# EAGLE design ATtiny45 development board (EAGLE 5.06)
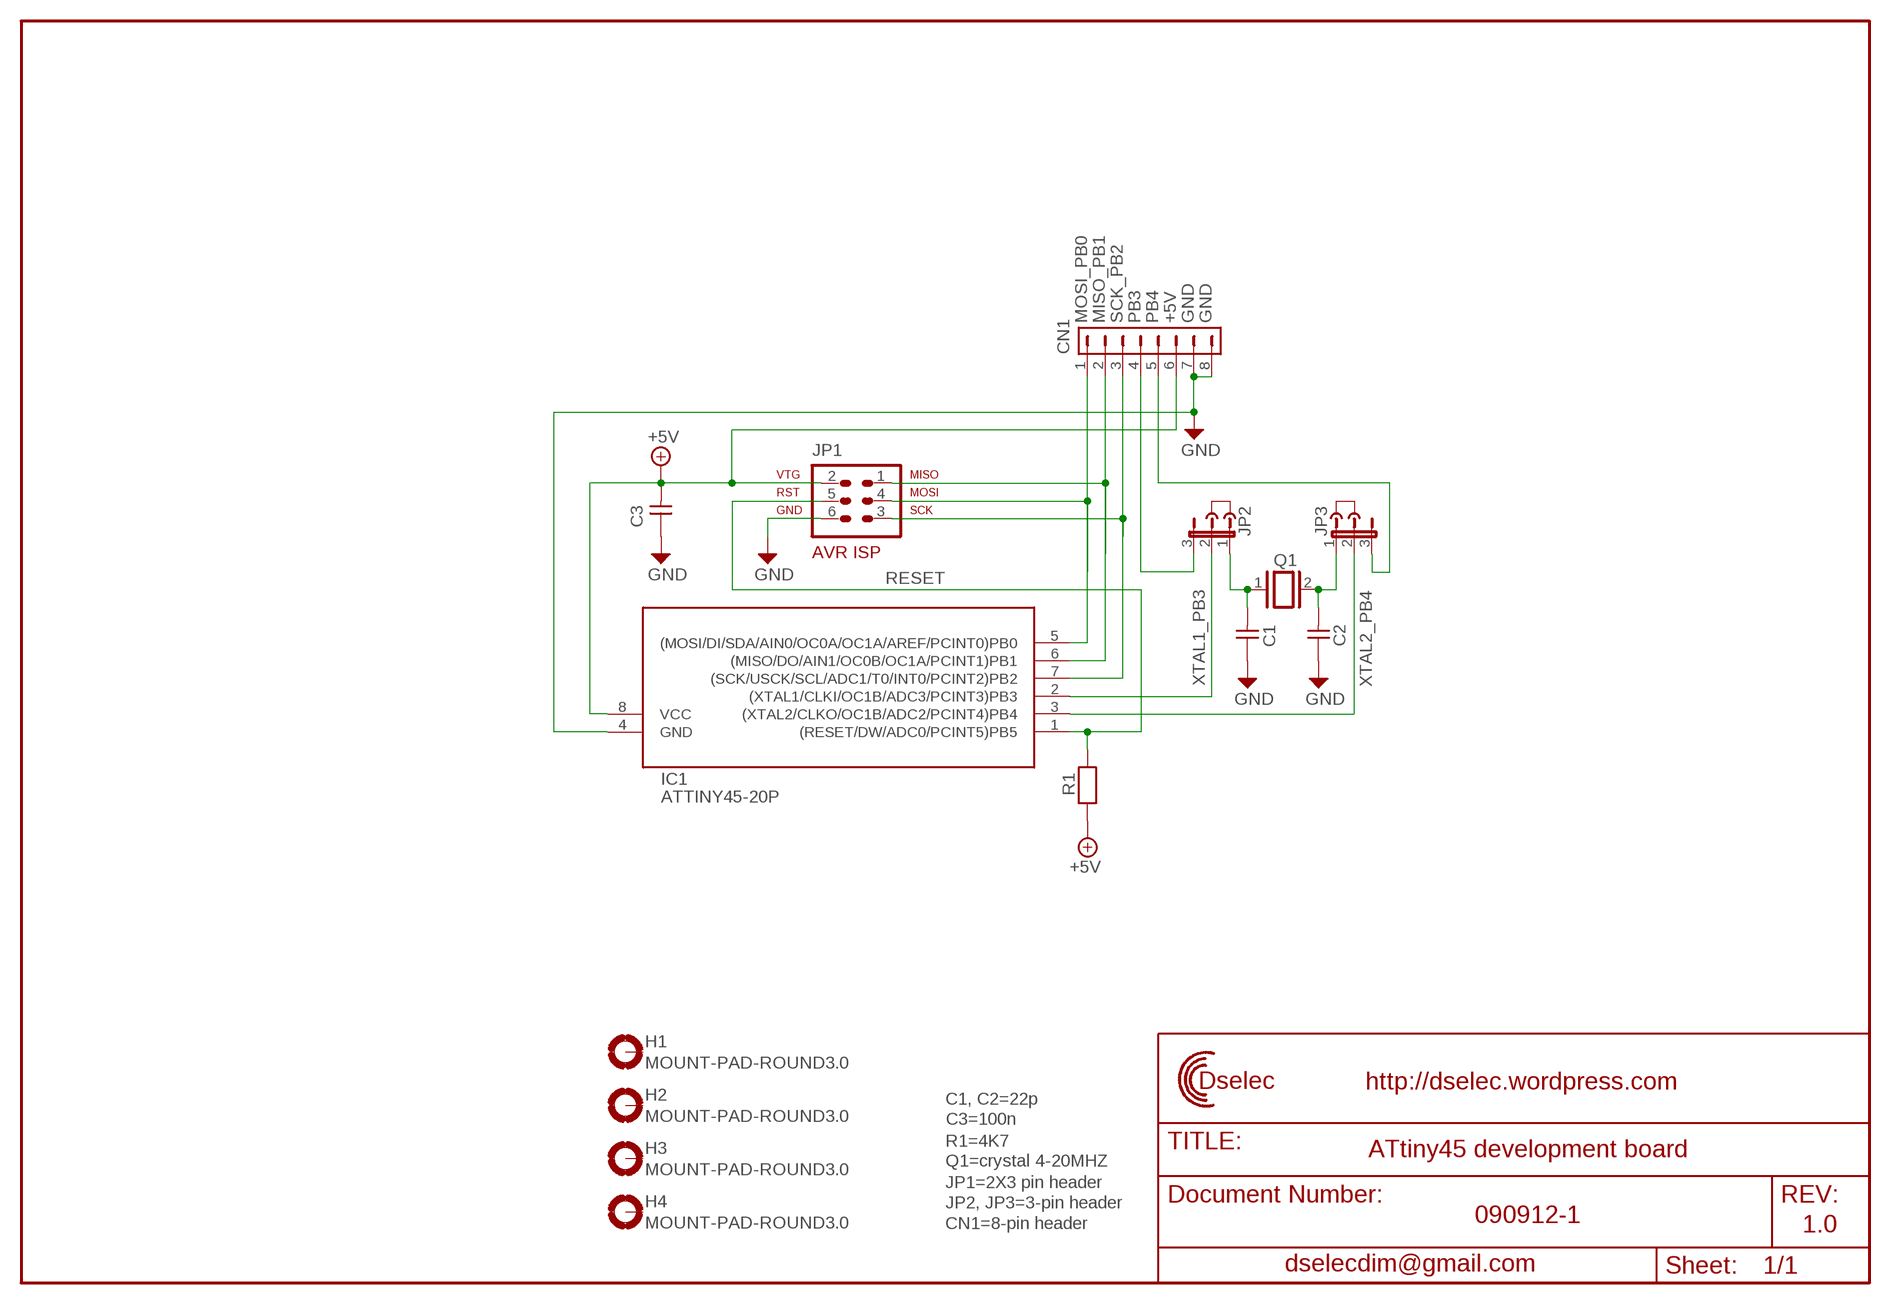
[diagram p0: schematic, sheet 1]

## Parts
C1  CAPNP-2,5  [C-2,5]
C2  CAPNP-2,5  [C-2,5]
C3  CAPNP-5  [C-5]
CN1  HDR-1X8-SIP-100  [SIP-100-8V]
H1  MOUNT-PAD-ROUND3.0  [3,0-PAD]
H2  MOUNT-PAD-ROUND3.0  [3,0-PAD]
H3  MOUNT-PAD-ROUND3.0  [3,0-PAD]
H4  MOUNT-PAD-ROUND3.0  [3,0-PAD]
IC1  ATTINY45-20P  [DIL08]
J1  JUMPER  [JUMP]
J2  JUMPER  [JUMP]
JP1  AVR-ISP-6  [AVR-ISP-6]
JP2  JP2E  [JP2]
JP3  JP2E  [JP2]
Q1  XTAL/S  [QS]
R1  RESEU-10  [R-10]

## Nets
+5V: C3.2 CN1.6 IC1.8(VCC) JP1.2 R1.1
GND: C1.1 C2.1 C3.1 CN1.7 CN1.8 IC1.4(GND) JP1.6
MISO_PB1: CN1.2 IC1.6((MISO/DO/AIN1/OC0B/OC1A/PCINT1)PB1) JP1.1
MOSI_PB0: CN1.1 IC1.5((MOSI/DI/SDA/AIN0/OC0A/OC1A/AREF/PCINT0)PB0) JP1.4
N$1: C1.2 JP2.1 Q1.1
N$2: C2.2 JP3.1 Q1.2
PB3: CN1.4 JP2.3
PB4: CN1.5 JP3.3
RESET: IC1.1((RESET/DW/ADC0/PCINT5)PB5) JP1.5 R1.2
SCK_PB2: CN1.3 IC1.7((SCK/USCK/SCL/ADC1/T0/INT0/PCINT2)PB2) JP1.3
XTAL1_PB3: IC1.2((XTAL1/CLKI/OC1B/ADC3/PCINT3)PB3) JP2.2
XTAL2_PB4: IC1.3((XTAL2/CLKO/OC1B/ADC2/PCINT4)PB4) JP3.2
Unconnected: H1.B3,0(MOUNT) H2.B3,0(MOUNT) H3.B3,0(MOUNT) H4.B3,0(MOUNT)

## Notes on the sheet
- C1, C2=22p
- C3=100n
- R1=4K7
- ATtiny45 development board
- Q1=crystal 4-20MHZ
- JP1=2X3 pin header
- JP2, JP3=3-pin header
- 090912-1
- CN1=8-pin header | 1.0

## Library data of the parts
C1 C2 = discrete:CAPNP-2,5
C3 = discrete:CAPNP-5
CN1 = con-hdrs40:HDR-1X8: HEADER CONNECTOR
H1-H4 = holes:MOUNT-PAD-ROUND: MOUNTING PAD, round
IC1 = avr:ATTINY45: MICROCONTROLLER 4 Kbytes FLASH 256 bytes EEPROM 256 bytes RAM 4-channel 10 bit ADC USI
J1 J2 = jumper:JUMPER: JUMPER header
JP1 = atmel-1:AVR-ISP-6: AVR ISP-6 Serial Programming Header
JP2 JP3 = jumper:JP2E: JUMPER
Q1 = special:XTAL/S: CRYSTAL
R1 = discrete:RESEU-10

## Net classes
0 default: width 0.305 mm

## Board
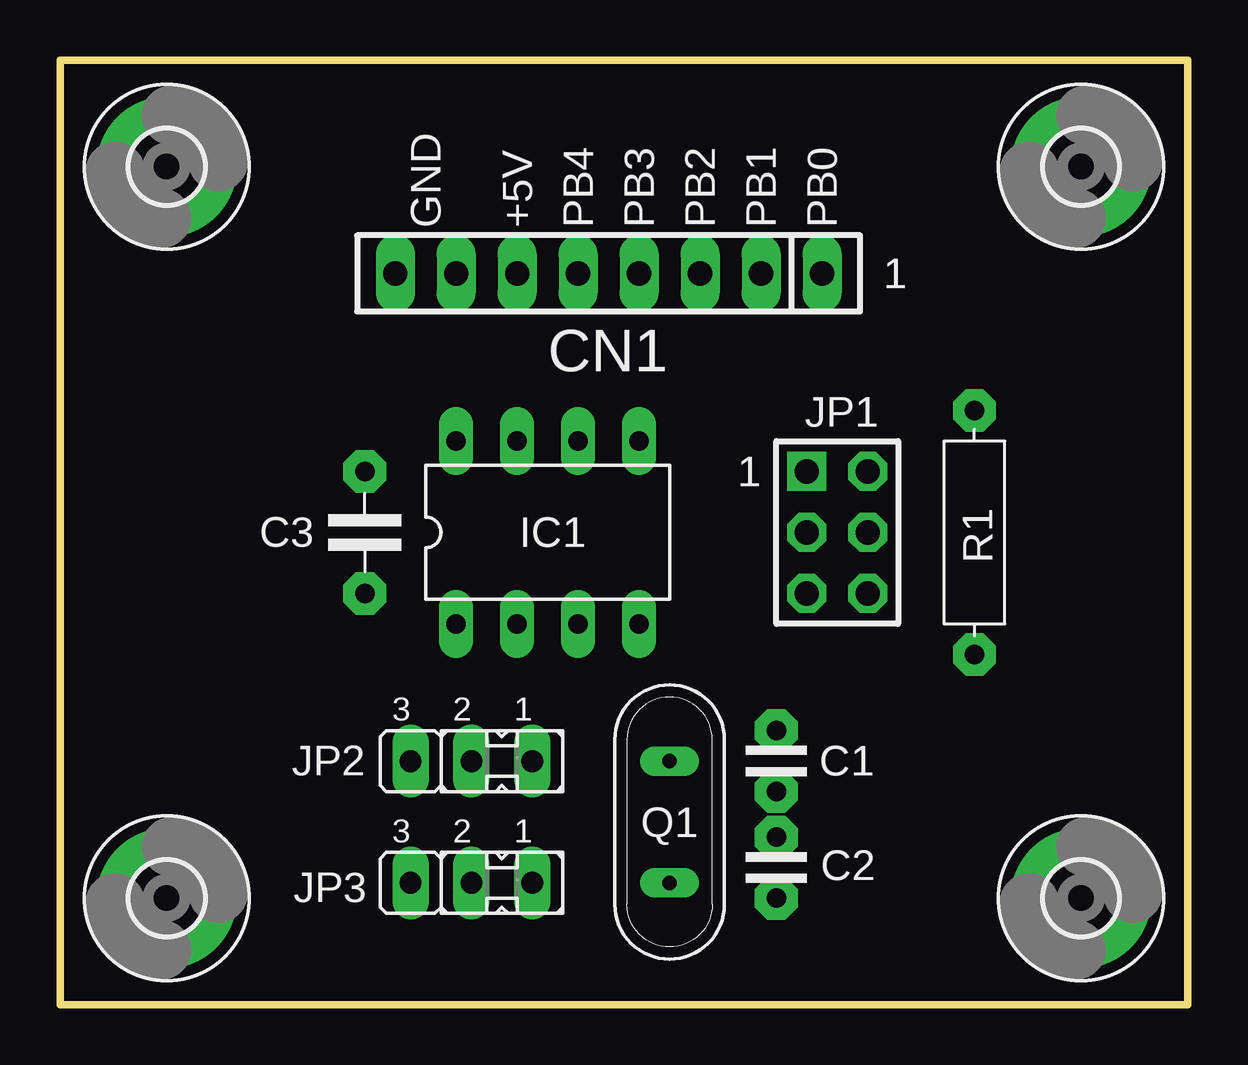
[diagram p1: board, top side]
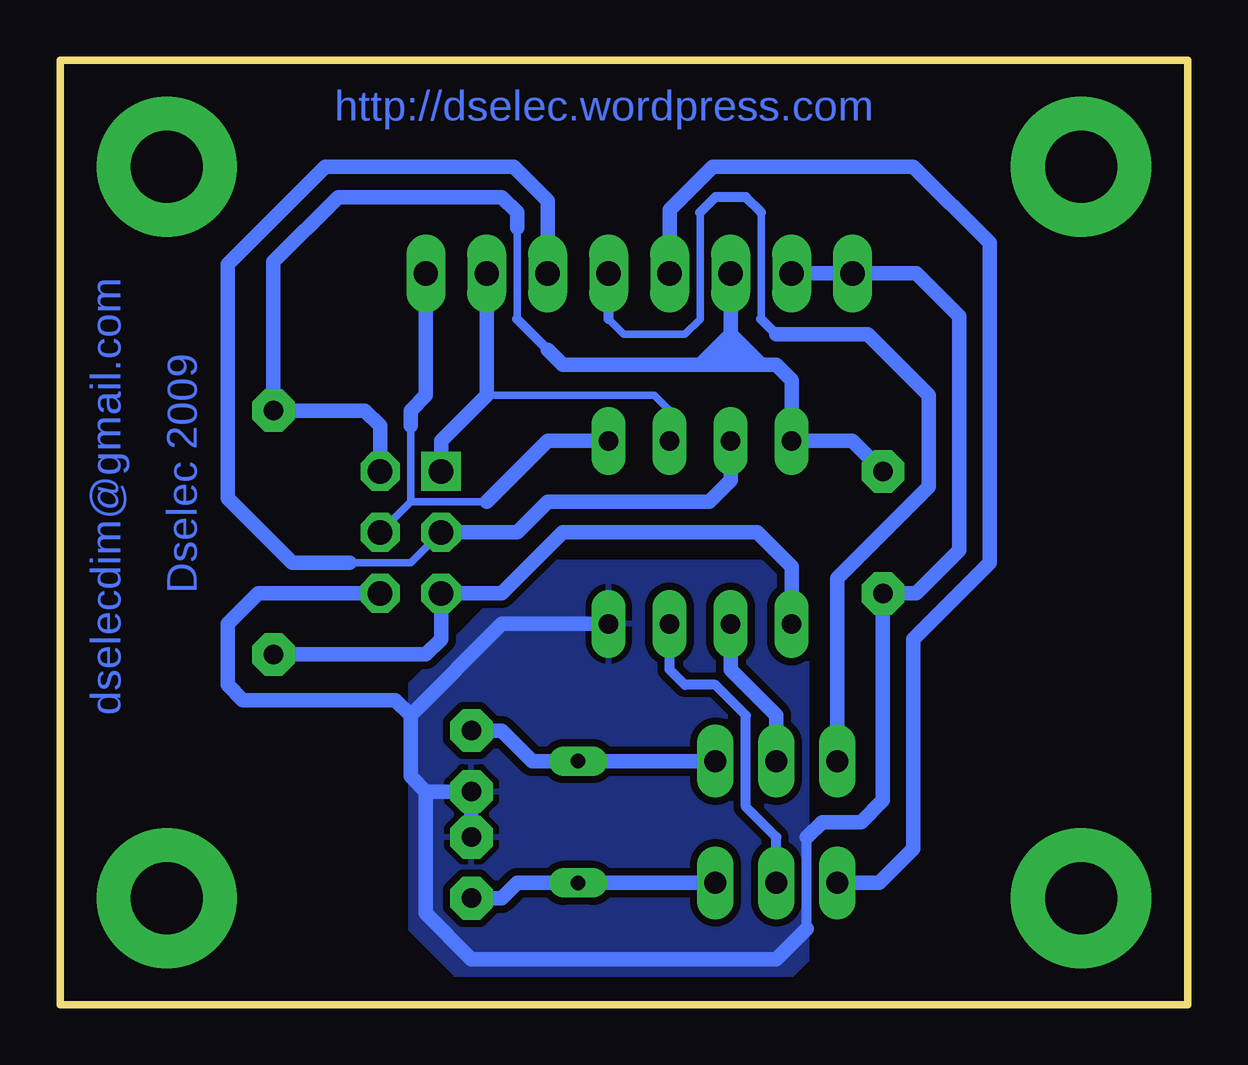
[diagram p2: board, bottom side, seen from below]

Size 46.99 x 39.37 mm. Coordinates in mm from the lower left corner, seen from the top.
Outline: 0,0 0,39.37 46.99,39.37 46.99,0 0,0
Copper layers (1*16): Top 0.035mm / dielectric 1.5mm / Bottom 0.035mm
Design rules "lpkf": minimum track width 12mil, minimum drill 25mil, track to track 12mil, track to pad 12mil, pad to pad 12mil, via to via 12mil, smd to smd 12mil, copper to edge 40mil, drill to drill 8mil, minimum pad ring 12mil, minimum via ring 12mil, stop-mask expansion 0mil, vias tented up to drill 0mil, thermal gap 10mil

### Footprints (pad centres in the part's own frame; a part is rotated, then mirrored left to right if it is on the bottom)
C-2,5 = drill 0.813 pad 1.778 octagon: 1 -1.27,0; 2 1.27,0
C-5 = drill 0.813 pad 1.778 octagon: 1 -2.54,0; 2 2.54,0
SIP-100-8V = drill 1.016 long: 1 -8.89,0; 2 -6.35,0; 3 -3.81,0; 4 -1.27,0; 5 1.27,0; 6 3.81,0; 7 6.35,0; 8 8.89,0
3,0-PAD = drill 3 pad 5.842 round: B3,0 0,0
DIL08 = drill 0.813 long: 1 -3.81,-3.81; 2 -1.27,-3.81; 3 1.27,-3.81; 4 3.81,-3.81; 5 3.81,3.81; 6 1.27,3.81; 7 -1.27,3.81; 8 -3.81,3.81
AVR-ISP-6 = drill 1.016 square: 1 -2.54,-1.27 | drill 1.016 octagon: 2 -2.54,1.27; 3 0,-1.27; 4 0,1.27; 5 2.54,-1.27; 6 2.54,1.27
JP2 = drill 0.914 long: 1 -2.54,0; 2 0,0; 3 2.54,0
QS = drill 0.61 long: 1 -2.54,0; 2 2.54,0
R-10 = drill 0.813 pad 1.778 octagon: 1 -5.08,0; 2 5.08,0

### Placement (x,y rotation side)
C1  29.84,10.16 90 top
C2  29.84,5.71 270 top
C3  12.7,19.68 90 top
CN1  22.86,30.48 180 top
H1  4.45,34.92 0 top
H2  4.45,4.45 0 top
H3  42.55,34.92 0 top
H4  42.55,4.45 0 top
IC1  20.32,19.68 0 top
J1  18.41,10.16 270 top
J2  18.41,5.08 270 top
JP1  32.38,19.68 270 top
JP2  17.14,10.16 180 top
JP3  17.14,5.08 180 top
Q1  25.4,7.62 270 top
R1  38.1,19.68 270 top

### Tracks (layer width: path | path; a pad name or v marks a point on that pad's centre or on a via)
+5V
  Bottom 0.305: 27.94,28.57 27.94,32.38
  Bottom 0.406: 26.67,27.3 27.94,28.57
  Bottom 0.61: JP1.2 33.66,24.13 34.29,24.77 R1.1 38.1,30.96 35.41,33.66 28.57,33.66 27.94,33.02 27.94,32.38 | C3.2 13.97,23.5 IC1.8 16.51,26.04 17.14,26.67 17.78,26.67 | 18.41,26.67 19.05,26.67 | 19.05,26.67 19.05,27.3 | 19.05,27.94 19.05,27.3 | 19.05,27.94 CN1.6 | 19.05,26.67 19.68,26.67 | 20.32,26.67 19.68,26.67 | 20.32,26.67 26.04,26.67 26.67,27.3 | 19.05,27.94 20.32,26.67 | 17.78,26.67 19.05,27.94 | 17.78,26.67 18.41,26.67 | 18.41,26.67 19.05,27.3 | 19.05,27.3 19.68,26.67
GND
  Bottom 0.406: 15.88,3.17 15.88,6.99
  Bottom 0.61: CN1.7 CN1.8 11.32,30.48 9.53,28.68 9.53,18.94 11.32,17.14 C3.1 12.7,8.52 13.6,7.62 15.24,7.62 15.88,6.99 | 31.75,8.89 C1.1 C2.1 | 15.88,3.17 17.14,1.91 29.84,1.91 31.75,3.81 31.75,8.89 | IC1.4 28.57,15.88 32.38,12.06 | 32.38,12.06 32.38,9.53 31.75,8.89 | JP1.6 38.73,17.14 40.01,15.88 40.01,13.34 39.37,12.7 33.02,12.7 32.38,12.06
  pour Bottom: 18.41,18.41 27.3,18.41 32.38,13.34 32.38,3.17 30.48,1.27 16.51,1.27 15.88,1.91 15.88,16.51 17.78,18.41
MISO_PB1
  Bottom 0.305: IC1.6 21.59,24.77 22.23,25.4 29.21,25.4
  Bottom 0.61: JP1.1 31.11,23.5 29.21,25.4 CN1.2
MOSI_PB0
  Bottom 0.305: 29.21,20.95 32.38,20.95 | 32.38,20.95 JP1.4 | 32.38,20.95 32.38,24.13
  Bottom 0.61: IC1.5 26.67,23.5 29.21,20.95 | CN1.1 31.75,25.4 32.38,24.77 32.38,24.13
N$1
  Bottom 0.61: JP2.1 Q1.1 27.3,10.16 28.57,11.43 C1.2
N$2
  Bottom 0.61: JP3.1 Q1.2 27.94,5.08 28.57,4.45 C2.2
PB3
  Bottom 0.305: 17.78,28.57 17.78,33.02 | 20.32,33.02 20.32,28.57 20.95,27.94 23.5,27.94 24.13,28.57
  Bottom 0.406: 17.14,27.94 17.78,28.57 | 17.78,33.02 18.41,33.66 19.68,33.66 20.32,33.02 | 24.13,28.57 CN1.4
  Bottom 0.61: 17.14,27.94 13.34,27.94 10.79,25.4 10.79,21.59 14.61,17.78 JP2.3
PB4
  Bottom 0.61: JP3.3 12.85,5.08 11.43,6.5 11.43,15.24 8.26,18.41 8.26,31.75 11.43,34.92 19.79,34.92 21.59,33.13 CN1.5
RESET
  Bottom 0.61: IC1.1 16.51,18.27 17.93,19.68 26.04,19.68 28.57,17.14 JP1.5 31.11,15.24 31.75,14.61 R1.2
SCK_PB2
  Bottom 0.305: 34.92,18.41 32.38,18.41 JP1.3
  Bottom 0.61: IC1.7 19.05,21.85 19.95,20.95 26.67,20.95 27.94,19.68 JP1.3 | CN1.3 26.67,33.51 28.09,34.92 35.94,34.92 40.01,30.86 40.01,21.11 37.31,18.41 34.92,18.41
XTAL1_PB3
  Bottom 0.61: IC1.2 19.05,13.97 17.14,12.06 JP2.2
XTAL2_PB4
  Bottom 0.305: 18.41,8.26 18.41,8.89
  Bottom 0.406: IC1.3 21.59,13.97 20.95,13.34 19.68,13.34 18.41,12.06 18.41,8.26 17.14,6.99 JP3.2

### Text on the board
Bottom: http://dselec.wordpress.com | Dselec 2009 | dselecdim@gmail.com
tNames: GND | +5V | PB4 | PB3 | PB2 | PB1 | PB0 | 1 | 1